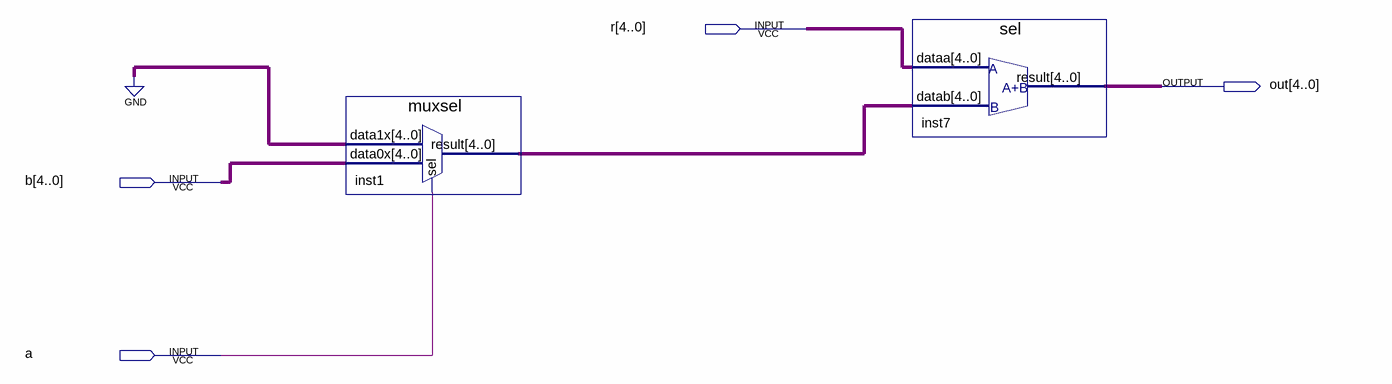
[diagram p0: schematic sheet]
// Quartus schematic 5bitMultiplication.bdf as structural Verilog: 2 symbols, 4 pins
module \5bitMultiplication  (
  input  [4:0] r,
  input  [4:0] b,
  input  a,
  output [4:0] out
);

  wire [4:0] inst1_result;

  muxsel inst1 (.data1x({5{1'b0}}), .data0x(b), .sel(a), .result(inst1_result));
  sel inst7 (.dataa(r), .datab(inst1_result), .result(out));
endmodule
